# Altium schematic sheet switches.SchDoc: Switches and LEDs
size A4; Organization: Berne University of Applied Science; Address1: School of Engineering and; Address2: Information Technology; Address3: Quellgasse 21; Address4: CH-2501 Biel; Revision: 1.0; SheetNumber: 12; SheetTotal: 19; ApprovedBy: zem1; Author: zac1
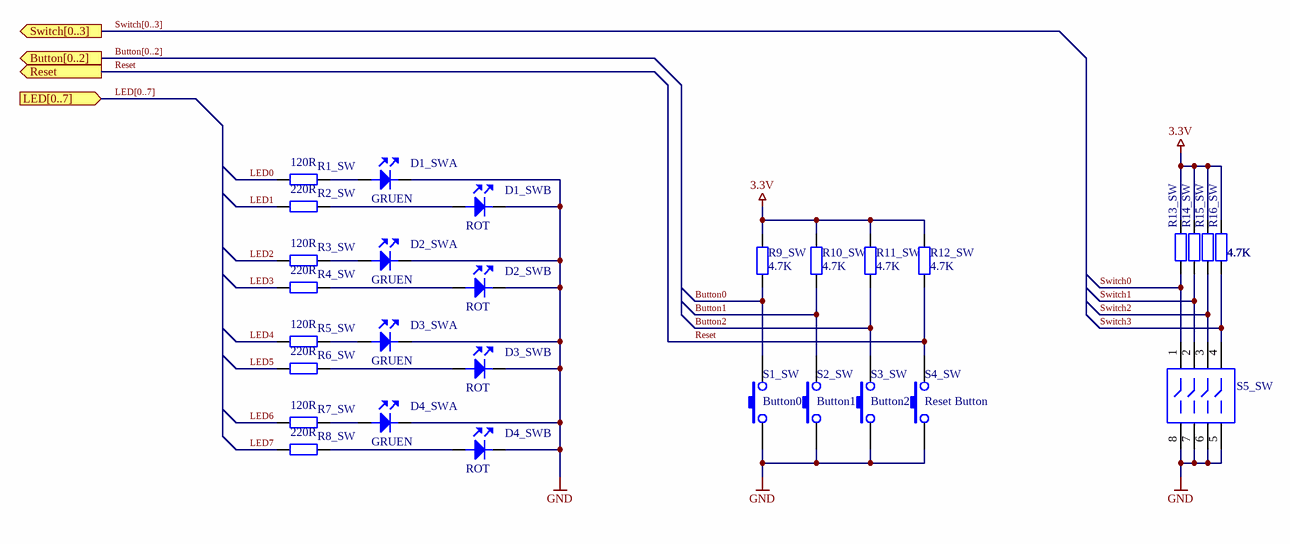
[diagram p0: switches.SchDoc]

## Parts
D1_SW  1211C-LED  [stan-led4]  (value not drawn)  (parts A,B of 2)
D2_SW  1211C-LED  [stan-led4]  (value not drawn)  (parts A,B of 2)
D3_SW  1211C-LED  [stan-led4]  (value not drawn)  (parts A,B of 2)
D4_SW  1211C-LED  [stan-led4]  (value not drawn)  (parts A,B of 2)
R1_SW  value 120R  [0402]  (hidden comment: Res2)
R2_SW  value 220R  [0402]  (hidden comment: Res2)
R3_SW  value 120R  [0402]  (hidden comment: Res2)
R4_SW  value 220R  [0402]  (hidden comment: Res2)
R5_SW  value 120R  [0402]  (hidden comment: Res2)
R6_SW  value 220R  [0402]  (hidden comment: Res2)
R7_SW  value 120R  [0402]  (hidden comment: Res2)
R8_SW  value 220R  [0402]  (hidden comment: Res2)
R9_SW  value 4.7K  [0402]  (hidden comment: Res2)
R10_SW  value 4.7K  [0402]  (hidden comment: Res2)
R11_SW  value 4.7K  [0402]  (hidden comment: Res2)
R12_SW  value 4.7K  [0402]  (hidden comment: Res2)
R13_SW  value 4.7K  [0402]  (hidden comment: Res2)
R14_SW  value 4.7K  [0402]  (hidden comment: Res2)
R15_SW  value 4.7K  [0402]  (hidden comment: Res2)
R16_SW  value 4.7K  [0402]  (hidden comment: Res2)
S1_SW  Button0  [FSM]
S2_SW  Button1  [FSM]
S3_SW  Button2  [FSM]
S4_SW  Reset Button  [FSM]
S5_SW  SW-DIP4  [DIP4]  (value not drawn)

## Ports
Button[0..2] (out), LED[0..7] (in), Reset (out), Switch[0..3] (out)

## Nets
3.3V: R9_SW.1 R10_SW.1 R11_SW.1 R12_SW.1 R13_SW.2 R14_SW.2 R15_SW.2 R16_SW.2
GND: D1_SW.2(K) D1_SW.4(K) D2_SW.2(K) D2_SW.4(K) D3_SW.2(K) D3_SW.4(K) D4_SW.2(K) D4_SW.4(K) S1_SW.2 S2_SW.2 S3_SW.2 S4_SW.1 S5_SW.5 S5_SW.6 S5_SW.7 S5_SW.8
Button0: R9_SW.2 S1_SW.1
Button1: R10_SW.2 S2_SW.1
Button2: R11_SW.2 S3_SW.1
LED0: R1_SW.2
LED1: R2_SW.2
LED2: R3_SW.2
LED3: R4_SW.2
LED4: R5_SW.2
LED5: R6_SW.2
LED6: R7_SW.2
LED7: R8_SW.2
Reset: R12_SW.2 S4_SW.2 ; port Reset
Switch0: R13_SW.1 S5_SW.1
Switch1: R14_SW.1 S5_SW.2
Switch2: R15_SW.1 S5_SW.3
Switch3: R16_SW.1 S5_SW.4
NetD1_SW_1: D1_SW.1(A) R2_SW.1
NetD1_SW_3: D1_SW.3(A) R1_SW.1
NetD2_SW_1: D2_SW.1(A) R4_SW.1
NetD2_SW_3: D2_SW.3(A) R3_SW.1
NetD3_SW_1: D3_SW.1(A) R6_SW.1
NetD3_SW_3: D3_SW.3(A) R5_SW.1
NetD4_SW_1: D4_SW.1(A) R8_SW.1
NetD4_SW_3: D4_SW.3(A) R7_SW.1

## Buses and harness runs
bus Button[0..2] = port Button[0..2]
bus LED[0..7] = port LED[0..7]
bus Switch[0..3] = port Switch[0..3]

## Notes on the sheet
- Title:
- Size:
- Date:
- A4_L
- Author:
- Time:
- Revision:
- Sheet
- of
- File:
- (in symbol 1211C-LED, part A) GRUEN
- (in symbol 1211C-LED, part B) ROT

## Library data of the parts
D1_SW D2_SW D3_SW D4_SW = 1211C-LED: Stanley 1211C Bi-Color Ultra Compact SMT LED; Value: BRBG1211C; Currency: CHF; Packaging unit: 1; Prize: 0.86; Distributor Number: 253183; Manufacturer: Stanley; Part Number: BRBG1211C; RoHS: yes; Distributor: Distrelec
R1_SW R3_SW R5_SW R7_SW = Res2: Resistor; Manufacturer: PHYCOMP; Part Number: 232270671201; Class I: Passive; Currency: CHF; Packaging unit: 50; Prize: 0.12; Published: 8-Jun-2000; Revision: July-2002: Re-released for DXP Platform.; Publisher: Altium Limited; Class II: Resistor; Distributor Number: 9239120; RoHS: yes; Distributor: Farnell
R2_SW R4_SW R6_SW R8_SW = Res2: Resistor; Manufacturer: PHYCOMP; Part Number: 232270672201; Class I: Passive; Currency: CHF; Packaging unit: 50; Prize: 0.12; Published: 8-Jun-2000; Revision: July-2002: Re-released for DXP Platform.; Publisher: Altium Limited; Class II: Resistor; Distributor Number: 9239154; RoHS: yes; Distributor: Farnell
R9_SW R10_SW R11_SW R12_SW R13_SW R14_SW R15_SW R16_SW = Res2: Resistor; Manufacturer: PHYCOMP; Part Number: 232270674702; Class I: Passive; Currency: CHF; Packaging unit: 50; Prize: 0.12; Published: 8-Jun-2000; Revision: July-2002: Re-released for DXP Platform.; Publisher: Altium Limited; Class II: Resistor; Distributor Number: 9239316; RoHS: yes; Distributor: Farnell
S1_SW S2_SW S3_SW S4_SW = SW_PB: Manufacturer: TYCO; Part Number: 0-1437565-1; Value: FSM; Currency: CHF; Packaging unit: 1; Prize: 0.86; Distributor Number: 200858; RoHS: yes; Distributor: Distrelec
S5_SW = SW-DIP4: Manufacturer: Diptronics; Part Number: PM-040900; Currency: CHF; Packaging unit: 1; Prize: 3.34; Value: SW-DIP4; Distributor Number: 210036; RoHS: yes; Distributor: Distrelec